# EAGLE design TS3002 (EAGLE 7.6.0)
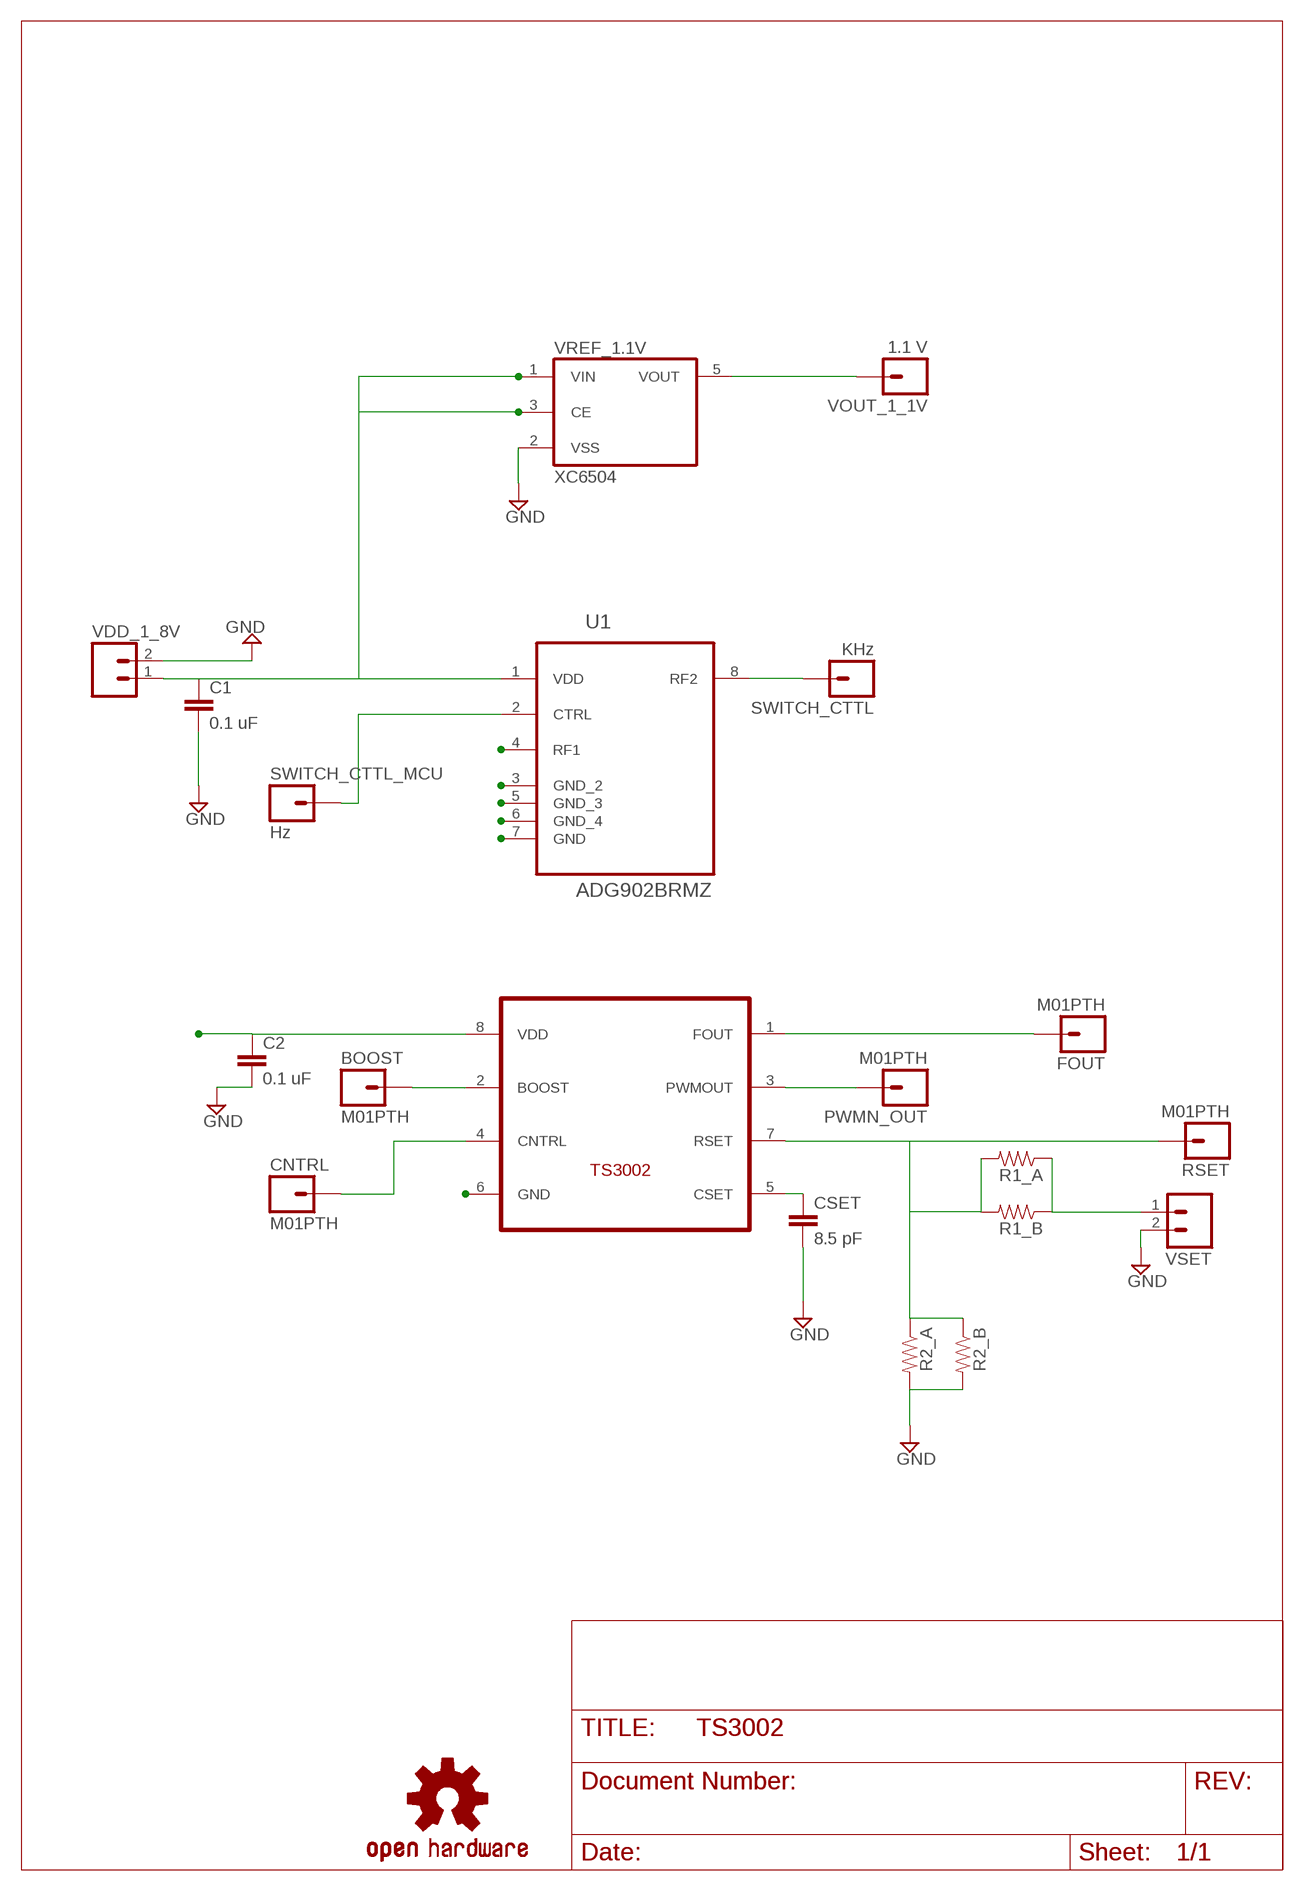
[diagram p0: schematic, sheet 1]

## Parts
BOOST  M01PTH  [1X01]
C1  0.1 uF  CAP0603-CAP  [0603-CAP]
C2  0.1 uF  CAP0603-CAP  [0603-CAP]
CNTRL  M01PTH  [1X01]
CSET  8.5 pF  CAP0603-CAP  [0603-CAP]
FOUT  M01PTH  [1X01]
LOGO1  OSHW-LOGOL  [OSHW-LOGO-L]
PWMN_OUT  M01PTH  [1X01]
R1_A  RESISTOR0603-RES  [0603-RES]
R1_B  RESISTOR0603-RES  [0603-RES]
R2_A  RESISTOR0603-RES  [0603-RES]
R2_B  RESISTOR0603-RES  [0603-RES]
RSET  M01PTH  [1X01]
SWITCH_CTTL  KHz  M01PTH  [1X01]
SWITCH_CTTL_MCU  Hz  M01PTH  [1X01]
U1  ADG902BRMZ  [SOP65P490X110-8N]
U$1  TS3002  [TDFN22-8]
VDD_1_8V  M02PTH  [1X02]
VOUT_1_1V  1.1 V  M01PTH  [1X01]
VREF_1.1V  XC6504  XC6220MR  [SOT23-5]
VSET  M02PTH  [1X02]

## Nets
1_2OUT: C2.1 U$1.8(VDD) VOUT_1_1V.1 VREF_1.1V.5(VOUT)
GND: C1.2 C2.2 CSET.2 R2_A.2 R2_B.2 U1.3(GND_2) U1.5(GND_3) U1.6(GND_4) U1.7(GND) U$1.6(GND) VDD_1_8V.2 VREF_1.1V.2(VSS) VSET.2
N$1: R1_A.1 R1_B.1 VSET.1
N$2: SWITCH_CTTL_MCU.1 U1.2(CTRL)
N$3: BOOST.1 U$1.2(BOOST)
N$4: SWITCH_CTTL.1 U1.8(RF2)
N$5: CNTRL.1 U$1.4(CNTRL)
N$6: R1_A.2 R1_B.2 R2_A.1 R2_B.1 RSET.1 U$1.7(RSET)
N$7: PWMN_OUT.1 U$1.3(PWMOUT)
N$8: CSET.1 U$1.5(CSET)
TIMER: FOUT.1 U1.4(RF1) U$1.1(FOUT)
VDD_1.8V1: C1.1 U1.1(VDD) VDD_1_8V.1 VREF_1.1V.1(VIN) VREF_1.1V.3(CE)

## Library data of the parts
BOOST CNTRL FOUT PWMN_OUT RSET SWITCH_CTTL SWITCH_CTTL_MCU VOUT_1_1V = SparkFun:M01: Header 1 Standard 1-pin 0.1" header. Use with straight break away headers (SKU : PRT-00116), right angle break away headers (PRT-00553), swiss pins (PRT-00743), machine pins (PRT-00117), and female headers (PRT-00115).
C1 C2 CSET = SparkFun-Capacitors:CAP: Capacitor Standard 0603 ceramic capacitor, and 0.1" leaded capacitor.
LOGO1 = SparkFun-Aesthetics:OSHW-LOGO: Open Source Hardware Logo This logo indicates the piece of hardware it is found on incorporates a OSHW license and/or adheres to the definition of open source hardware found here: http://freedomdefined.org/OSHW
R1_A R1_B R2_A R2_B = SparkFun-Passives:RESISTOR: Resistor Basic schematic elements and footprints for 0603, 1206, and PTH resistors.
U1 = analog-devices-Phase-2:ADG902BRMZ: 1.65 V to 2.75 V, SPST Switches; MPN: ADG902BRMZ; OC_FARNELL: 1346345; OC_NEWARK: 59K1691; PACKAGE: MSOP-8; SUPPLIER: Analog Devices
U$1 = ts3002TDFN22_8pin:TS3002
VDD_1_8V VSET = SparkFun:M02: Header 2 Standard 2-pin 0.1" header. Use with straight break away headers (SKU : PRT-00116), right angle break away headers (PRT-00553), swiss pins (PRT-00743), machine pins (PRT-00117), and female headers (PRT-00115). Molex polarized connector foot print use with SKU : PRT-08233 with associated crimp pins and housings.
VREF_1.1V = torex:XC6220: LDO Regulator 1A

## Board
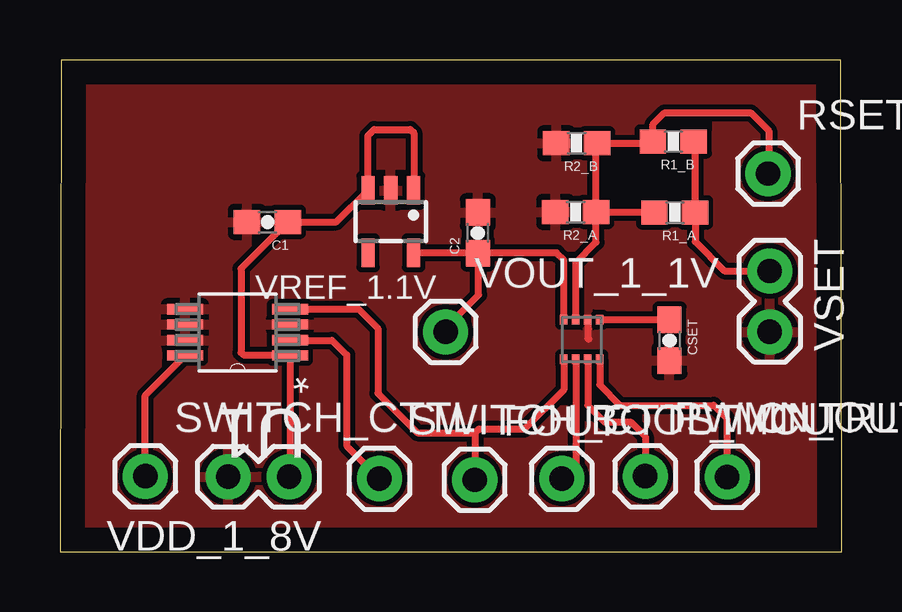
[diagram p1: board, top side]

Size 32.6 x 20.5 mm. Coordinates in mm from the lower left corner, seen from the top.
Outline: 0,0 32.6,0 32.55,20.5 0.05,20.5 0,0
Copper layers (1*16): Top 0.035mm / dielectric 1.5mm / Bottom 0.035mm
Design rules "default": minimum track width 10mil, minimum drill 24mil, track to track 8mil, track to pad 8mil, pad to pad 8mil, via to via 8mil, smd to smd 8mil, copper to edge 40mil, drill to drill 8mil, minimum pad ring 10mil, minimum via ring 8mil, stop-mask expansion 4mil, vias tented up to drill 0mil, thermal gap 10mil

### Footprints (pad centres in the part's own frame; a part is rotated, then mirrored left to right if it is on the bottom)
1X01 = drill 1.016 pad 1.88: 1 0,0
0603-CAP = smd 1.1 x 1: 1 -0.85,0; 2 0.85,0
0603-RES = smd 1.1 x 1: 1 -0.85,0; 2 0.85,0
SOP65P490X110-8N = smd 1.499 x 0.432: 1 -2.184,0.965; 2 -2.184,0.33; 3 -2.184,-0.33; 4 -2.184,-0.965; 5 2.184,-0.965; 6 2.184,-0.33; 7 2.184,0.33; 8 2.184,0.965
TDFN22-8 = smd 0.408 x 0.306: 1 -1.78,-0.7; 2 -1.78,-1.2; 4 -1.78,-2.2; 5 -0.13,-2.2; 6 -0.13,-1.7; 7 -0.13,-1.2; 8 -0.13,-0.7 | smd 0.407 x 0.306: 3 -1.78,-1.7
1X02 = drill 1.016 pad 1.88: 1 0,0; 2 2.54,0
SOT23-5 = smd 0.55 x 1.2: 1 -0.95,-1.3; 2 0,-1.3; 3 0.95,-1.3; 4 0.95,1.3; 5 -0.95,1.3

### Placement (x,y rotation side)
BOOST  20.92,3.04 0 top
C1  8.65,13.74 180 top
C2  17.42,13.29 90 top
CNTRL  27.82,3.11 0 top
CSET  25.41,8.81 270 top
FOUT  17.29,2.99 0 top
LOGO1  -0.38,47.09 0 top  (outside the outline)
PWMN_OUT  24.4,3.14 0 top
R1_A  25.63,14.14 180 top
R1_B  25.57,17.1 180 top
R2_A  21.5,14.16 180 top
R2_B  21.54,17.03 180 top
RSET  29.52,15.76 0 top
SWITCH_CTTL  3.56,3.14 0 top
SWITCH_CTTL_MCU  13.32,3.04 0 top
U1  7.4,9.14 180 top
U$1  20.3,9.8 90 top
VDD_1_8V  9.55,3.12 180 top
VOUT_1_1V  16.08,9.16 0 top
VREF_1.1V  13.79,13.76 180 top
VSET  29.59,11.7 270 top

### Tracks (layer width: path | path; a pad name or v marks a point on that pad's centre or on a via)
1_2OUT
  Top 0.3: U$1.8 21,12.15 20.7,12.45 C2.1 | C2.1 14.76,12.44 VREF_1.1V.5 | VOUT_1_1V.1 16.08,9.33 17.45,10.7 17.45,12.41 C2.1
GND
  Top 0.3: U$1.6 22,8.9 22.05,8.85
  pour Top: -11.81,78.84 -11.81,-4.98 97.41,-4.98 97.41,83.92 -11.81,83.92
N$1
  Top 0.3: R1_B.1 26.48,17.04 R1_A.1 26.48,12.92 27.7,11.7 VSET.1
N$2
  Top 0.3: U1.2 11.34,8.81 11.95,8.2 11.95,4.41 SWITCH_CTTL_MCU.1
N$3
  Top 0.3: U$1.2 21.5,3.62 BOOST.1
N$4
  Top 0.3: SWITCH_CTTL.1 3.56,6.52 U1.8
N$5
  Top 0.3: U$1.4 22.5,6.95 23.35,6.1 27.25,6.1 27.8,5.55 27.8,3.13 CNTRL.1
N$6
  Top 0.3: U$1.7 21.5,12.05 22.35,12.9 R2_A.1 | R2_A.1 24.76,14.16 R1_A.2 | R2_A.1 22.35,16.99 R2_B.1 24.65,17.03 R1_B.2 24.72,17.82 25.2,18.3 28.8,18.3 29.55,17.55 29.55,15.79 RSET.1
N$7
  Top 0.3: U$1.3 22,6.1 22.7,5.4 23.8,5.4 24.4,4.8 PWMN_OUT.1
N$8
  Top 0.3: U$1.5 CSET.1
TIMER
  Top 0.3: U$1.1 21,6.75 19.35,5.1 17.45,5.1 17.3,4.95 | 17.3,4.95 FOUT.1 | U1.4 12.45,10.11 13.25,9.3 13.25,6.6 14.9,4.95 17.3,4.95
VDD_1.8V1
  Top 0.3: VREF_1.1V.1 14.75,17.45 14.6,17.6 13.1,17.6 12.84,17.34 VREF_1.1V.3 11.52,13.74 C1.1 7.55,11.8 7.55,8.3 7.65,8.2 9.56,8.2 U1.1 9.58,3.15 VDD_1_8V.1